# EAGLE design draft3_4lyr-autoroute (EAGLE 6.1)
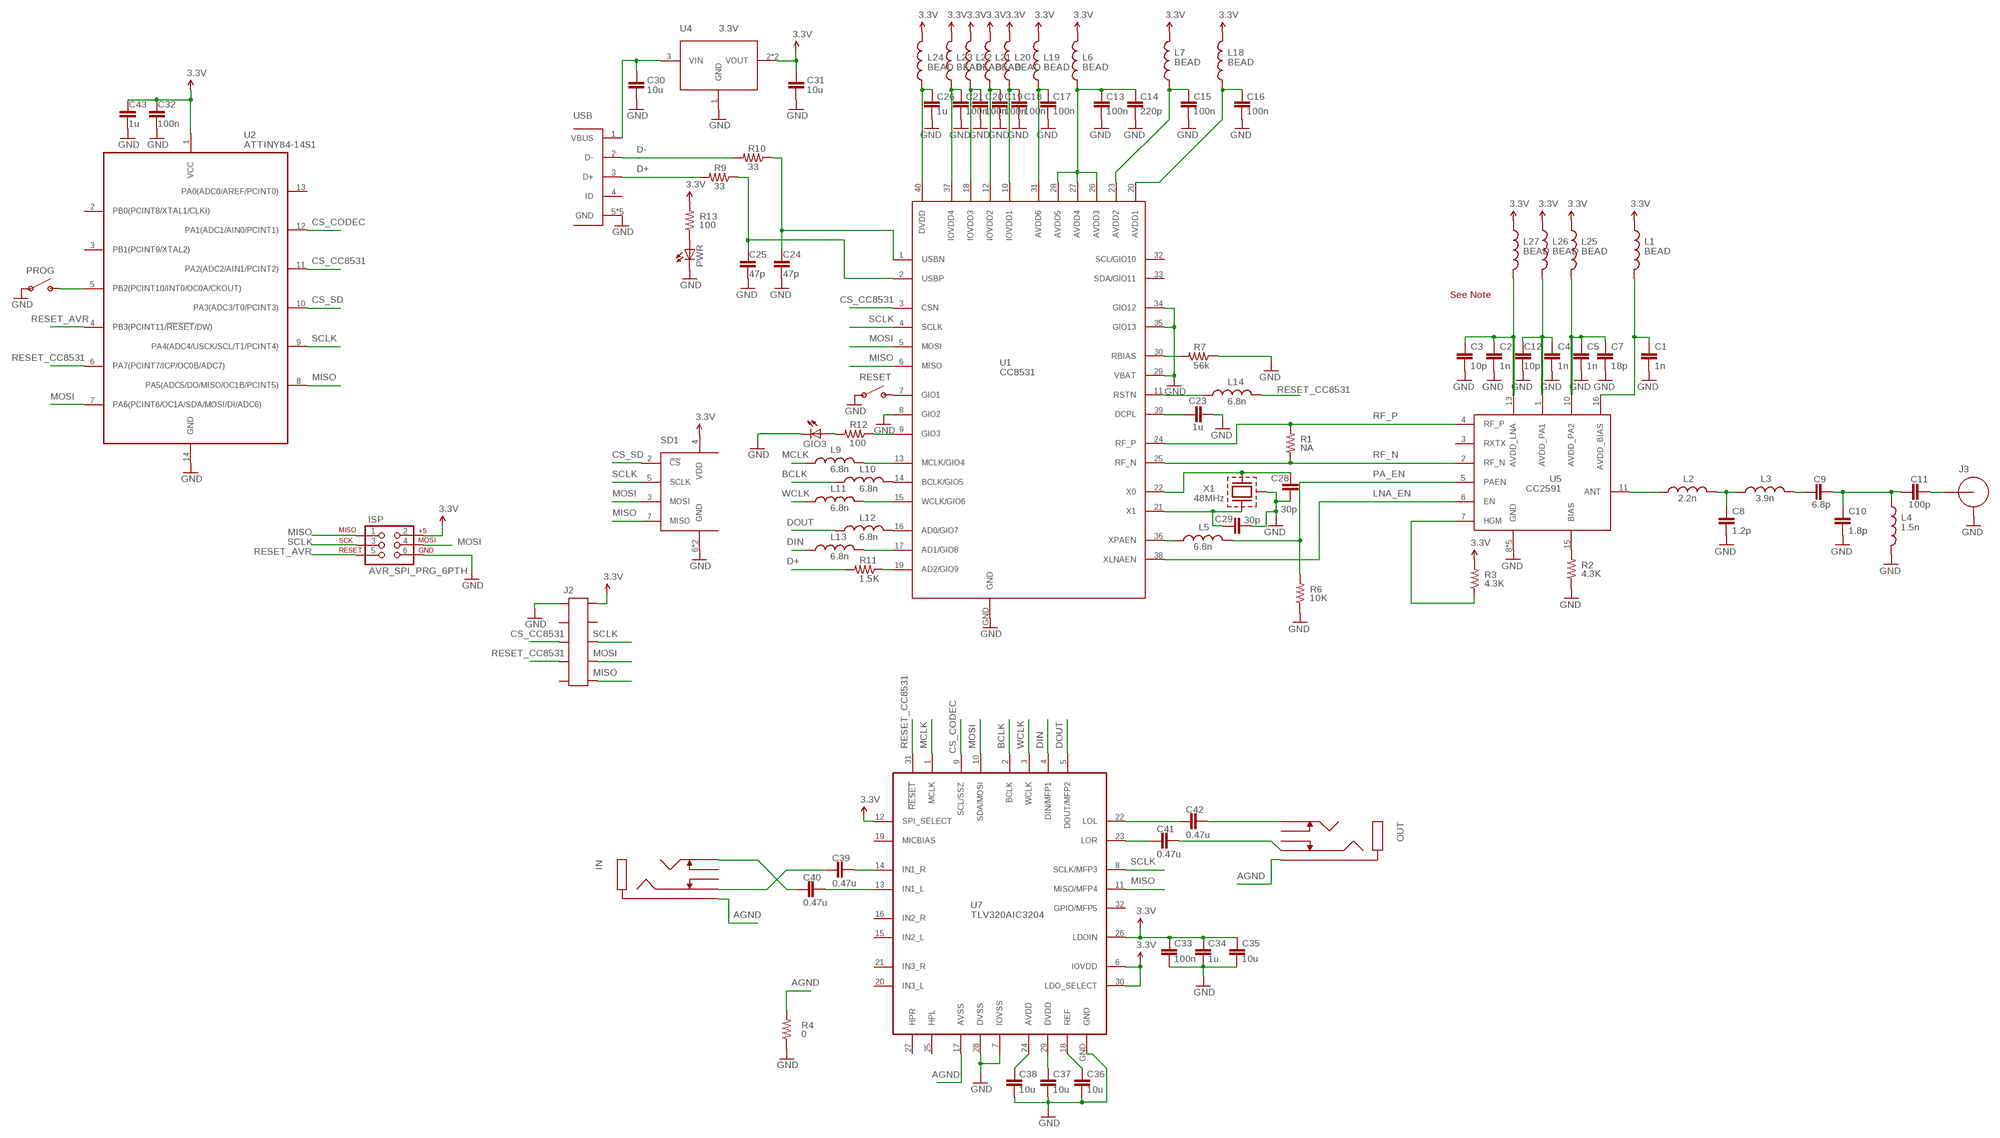
[diagram p0: schematic, sheet 1]

## Parts
C1  1n  C-EUC0603  [C0603]
C2  1n  C-EUC0603  [C0603]
C3  10p  C-EUC0603  [C0603]
C4  1n  C-EUC0603  [C0603]
C5  1n  C-EUC0603  [C0603]
C7  18p  C-EUC0603  [C0603]
C8  1.2p  C-EUC0603  [C0603]
C9  6.8p  C-EUC0603  [C0603]
C10  1.8p  C-EUC0603  [C0603]
C11  100p  C-EUC0603  [C0603]
C12  10p  C-EUC0603  [C0603]
C13  100n  C-EUC0603  [C0603]
C14  220p  C-EUC0603  [C0603]
C15  100n  C-EUC0603  [C0603]
C16  100n  C-EUC0603  [C0603]
C17  100n  C-EUC0603  [C0603]
C18  100n  C-EUC0603  [C0603]
C19  100n  C-EUC0603  [C0603]
C20  100n  C-EUC0603  [C0603]
C21  100n  C-EUC0603  [C0603]
C23  1u  C-EUC0603  [C0603]
C24  47p  C-EUC0603  [C0603]
C25  47p  C-EUC0603  [C0603]
C26  1u  C-EUC0603  [C0603]
C28  30p  C-EUC0603  [C0603]
C29  30p  C-EUC0603  [C0603]
C30  10u  C-EUC0603  [C0603]
C31  10u  C-EUC0603  [C0603]
C32  100n  C-EUC0603  [C0603]
C33  100n  C-EUC0603  [C0603]
C34  1u  C-EUC0603  [C0603]
C35  10u  C-EUC0603  [C0603]
C36  10u  C-EUC0603  [C0603]
C37  10u  C-EUC0603  [C0603]
C38  10u  C-EUC0603  [C0603]
C39  0.47u  C-EUC0603  [C0603]
C40  0.47u  C-EUC0603  [C0603]
C41  0.47u  C-EUC0603  [C0603]
C42  0.47u  C-EUC0603  [C0603]
C43  1u  C-EUC0603  [C0603]
GIO3  LEDCHIP-LED0603  [CHIP-LED0603]
IN  PHONE_SW  [35RAPC4BV4]
ISP  AVR_SPI_PRG_6PTH  [2X3]
J2  HEADER-10P-SMD-MALE  [10P-0.05-HEADER]
J3  SMA  [CONSMA003.031]
L1  BEAD  INDUCTOR0603  [0603]
L2  2.2n  INDUCTOR0603  [0603]
L3  3.9n  INDUCTOR0603  [0603]
L4  1.5n  INDUCTOR0603  [0603]
L5  6.8n  INDUCTOR0603  [0603]
L6  BEAD  INDUCTOR0603  [0603]
L7  BEAD  INDUCTOR0603  [0603]
L9  6.8n  INDUCTOR0603  [0603]
L10  6.8n  INDUCTOR0603  [0603]
L11  6.8n  INDUCTOR0603  [0603]
L12  6.8n  INDUCTOR0603  [0603]
L13  6.8n  INDUCTOR0603  [0603]
L14  6.8n  INDUCTOR0603  [0603]
L18  BEAD  INDUCTOR0603  [0603]
L19  BEAD  INDUCTOR0603  [0603]
L20  BEAD  INDUCTOR0603  [0603]
L21  BEAD  INDUCTOR0603  [0603]
L22  BEAD  INDUCTOR0603  [0603]
L23  BEAD  INDUCTOR0603  [0603]
L24  BEAD  INDUCTOR0603  [0603]
L25  BEAD  INDUCTOR0603  [0603]
L26  BEAD  INDUCTOR0603  [0603]
L27  BEAD  INDUCTOR0603  [0603]
OUT  PHONE_SW  [35RAPC4BV4]
PROG  SPST-SMD  [TACT_SW]
PWR  LEDCHIP-LED0603  [CHIP-LED0603]
R1  NA  R-US_R0603  [R0603]
R2  4.3K  R-US_R0603  [R0603]
R3  4.3K  R-US_R0603  [R0603]
R4  0  R-US_R0603  [R0603]
R6  10K  R-US_R0603  [R0603]
R7  56k  R-US_R0603  [R0603]
R9  33  R-US_R0603  [R0603]
R10  33  R-US_R0603  [R0603]
R11  1.5K  R-US_R0603  [R0603]
R12  100  R-US_R0603  [R0603]
R13  100  R-US_R0603  [R0603]
RESET  SPST-SMD  [TACT_SW]
SD1  MICROSDDM3AT  [DM3AT]
U1  CC8531  [S-PVQFN-N40]
U2  ATTINY84-14S1  [SOIC14]
U4  3.3V  NX1117C  [SOT-223]
U5  CC2591  [S-PVQFN-N16]
U7  TLV320AIC3204  [S-PVQFN-N32]
USB  USB_MICRO_AB  [USB_MICRO_AB]
X1  48MHz  XTAL-ABRACONABM3C  [ABM3C]

## Nets
3.3V: C31.1 C32.1 C33.1 C34.1 C35.1 C43.1 ISP.2 J2.2 L1.1 L6.2 L7.2 L18.2 L19.2 L20.2 L21.2 L22.2 L23.2 L24.2 L25.1 L26.1 L27.1 R3.2 R13.2 SD1.4(VDD) U2.1(VCC) U4.2(VOUT) U4.4(VOUT) U7.6(IOVDD) U7.12(SPI_SELECT) U7.26(LDOIN) U7.30(LDO_SELECT)
AGND: IN.1(GND) OUT.1(GND) R4.2 U7.17(AVSS)
AVDD_BIAS: C1.1 L1.2 U5.16(AVDD_BIAS)
AVDD_LNA: C2.1 C3.1 L27.2 U5.13(AVDD_LNA)
AVDD_PA1: C4.1 C12.1 L26.2 U5.1(AVDD_PA1)
AVDD_PA2: C5.1 C7.1 L25.2 U5.10(AVDD_PA2)
BCLK: L10.1 U7.2(BCLK)
CS_CC8531: J2.5 U1.3(CSN) U2.11(PA2(ADC2/AIN1/PCINT2))
CS_CODEC: U2.12(PA1(ADC1/AIN0/PCINT1)) U7.9(SCL/SSZ)
CS_SD: SD1.2(!CS) U2.10(PA3(ADC3/T0/PCINT3))
D+: R9.2 R11.2 USB.3(D+)
D-: R10.2 USB.2(D-)
DIN: L13.1 U7.4(DIN/MFP1)
DOUT: L12.1 U7.5(DOUT/MFP2)
GND: C1.2 C2.2 C3.2 C4.2 C5.2 C7.2 C8.2 C10.2 C12.2 C13.2 C14.2 C15.2 C16.2 C17.2 C18.2 C19.2 C20.2 C21.2 C23.2 C24.2 C25.2 C26.2 C28.2 C29.2 C30.2 C31.2 C32.2 C33.2 C34.2 C35.2 C36.2 C37.2 C38.2 C43.2 GIO3.C ISP.6 J2.1 J3.GND1(GND) J3.GND2(GND) J3.GND3(GND) J3.GND4(GND) L4.2 PROG.1 PROG.2 PWR.C R2.1 R4.1 R6.1 R7.1 RESET.1 RESET.2 SD1.6(GND) SD1.GND U1.8(GIO2) U1.29(VBAT) U1.34(GIO12) U1.35(GIO13) U1.GND U2.14(GND) U4.1(GND) U5.8(GND) U5.9(GND) U5.12(GND) U5.14(GND) U5.GND U7.7(IOVSS) U7.28(DVSS) U7.GND USB.5(GND) USB.GND1(GND) USB.GND2(GND) USB.GND3(GND) USB.GND4(GND) X1.2(CASE) X1.4(CASE)
IOVDD1: C24.1 R10.1 U1.1(USBN)
IOVDD2: C25.1 R9.1 U1.2(USBP)
LNA_EN: U1.38(XLNAEN) U5.6(EN)
MCLK: L9.1 U7.1(MCLK)
MISO: ISP.1 J2.10 SD1.7(MISO) U1.6(MISO) U2.8(PA5(ADC5/DO/MISO/OC1B/PCINT5)) U7.11(MISO/MFP4)
MOSI: ISP.4 J2.8 SD1.3(MOSI) U1.5(MOSI) U2.7(PA6(PCINT6/OC1A/SDA/MOSI/DI/ADC6)) U7.10(SDA/MOSI)
N$1: C29.1 U1.21(X1) X1.1
N$2: C28.1 U1.22(X0) X1.3
N$3: L14.1 U1.11(RSTN)
N$4: PROG.3 PROG.4 U2.5(PB2(PCINT10/INT0/OC0A/CKOUT))
N$5: L10.2 U1.14(BCLK/GIO5)
N$6: C30.1 U4.3(VIN) USB.1(VBUS)
N$7: R2.2 U5.15(BIAS)
N$8: R3.1 U5.7(HGM)
N$9: C11.2 J3.SIG
N$10: L12.2 U1.16(AD0/GIO7)
N$11: RESET.3 RESET.4 U1.7(GIO1)
N$12: C38.1 U7.24(AVDD)
N$13: L2.1 U5.11(ANT)
N$14: C8.1 L2.2 L3.1
N$15: C9.1 L3.2
N$16: C9.2 C10.1 C11.1 L4.1
N$17: C13.1 C14.1 L6.1 U1.26(AVDD3) U1.27(AVDD4) U1.28(AVDD5)
N$18: L5.1 U1.36(XPAEN)
N$19: R7.2 U1.30(RBIAS)
N$20: C36.1 U7.18(REF)
N$21: C23.1 U1.39(DCPL)
N$22: C15.1 L7.1 U1.23(AVDD2)
N$23: L9.2 U1.13(MCLK/GIO4)
N$24: R11.1 U1.19(AD2/GIO9)
N$25: L11.2 U1.15(WCLK/GIO6)
N$26: C16.1 L18.1 U1.20(AVDD1)
N$27: L13.2 U1.17(AD1/GIO8)
N$28: R12.1 U1.9(GIO3)
N$29: GIO3.A R12.2
N$30: C17.1 L19.1 U1.31(AVDD6)
N$31: PWR.A R13.1
N$32: C37.1 U7.29(DVDD)
N$33: C40.1 IN.2(L)
N$34: C39.2 U7.14(IN1_R)
N$35: C40.2 U7.13(IN1_L)
N$36: C39.1 IN.4(R)
N$37: C42.2 OUT.2(L)
N$38: C41.2 OUT.4(R)
N$39: C42.1 U7.22(LOL)
N$40: C41.1 U7.23(LOR)
N$41: C18.1 L20.1 U1.10(IOVDD1)
N$42: C19.1 L21.1 U1.12(IOVDD2)
N$43: C20.1 L22.1 U1.18(IOVDD3)
N$44: C21.1 L23.1 U1.37(IOVDD4)
N$45: C26.1 L24.1 U1.40(DVDD)
PA_EN: L5.2 R6.2 U5.5(PAEN)
RESET_AVR: ISP.5 U2.4(PB3(PCINT11/!RESET!/DW))
RESET_CC8531: J2.7 L14.2 U2.6(PA7(PCINT7/ICP/OC0B/ADC7)) U7.31(!RESET)
RF_N: R1.1 U1.25(RF_N) U5.2(RF_N)
RF_P: R1.2 U1.24(RF_P) U5.4(RF_P)
SCLK: ISP.3 J2.6 SD1.5(SCLK) U1.4(SCLK) U2.9(PA4(ADC4/USCK/SCL/T1/PCINT4)) U7.8(SCLK/MFP3)
WCLK: L11.1 U7.3(WCLK)
Unconnected: IN.3(R_SW) IN.5(L_SW) J2.3 J2.4 J2.9 OUT.3(R_SW) OUT.5(L_SW) U1.32(SCL/GIO10) U1.33(SDA/GIO11) U2.2(PB0(PCINT8/XTAL1/CLKI)) U2.3(PB1(PCINT9/XTAL2)) U2.13(PA0(ADC0/AREF/PCINT0)) U5.3(RXTX) U7.15(IN2_L) U7.16(IN2_R) U7.19(MICBIAS) U7.20(IN3_L) U7.21(IN3_R) U7.25(HPL) U7.27(HPR) U7.32(GPIO/MFP5) USB.4(ID)

## Notes on the sheet
- See Note

## Library data of the parts
C1-C5 C7-C21 C23-C26 C28-C43 = rcl:C-EU: CAPACITOR, European symbol
GIO3 PWR = led:LED: LED OSRAM: - CHIPLED LG R971, LG N971, LY N971, LG Q971, LY Q971, LO R971, LY R971 LH N974, LH R974 LS Q976, LO Q976, LY Q976 LO Q996 - Hyper CHIPLED LW Q18S LB Q993, LB Q99A, LB R99A - SideLED LS A670, LO A670, LY A670, LG A670, LP A670 LB A673, LV A673, LT A673, LW A673 LH A674 LY A675 LS A676, LA A676, LO A676, LY A676, LW A676 LS A679, LY A679, LG A679 - Hyper Micro SIDELED® LS Y876, LA Y876, LO Y876, LY Y876 LT Y87S - SmartLED LW L88C, LW L88S LB L89C, LB L89S, LG L890 LS L89K, LO L89K, LY L89K LS L896, LA L896, LO L896, LY L896 - TOPLED LS T670, LO T670, LY T670, LG T670, LP T670 LSG T670, LSP T670, LSY T670, LOP T670, LYG T670 LG T671, LOG T671, LSG T671 LB T673, LV T673, LT T673, LW T673 LH T674 LS T676, LA T676, LO T676, LY T676, LB T676, LH T676, LSB T676, LW T676 LB T67C, LV T67C, LT T67C, LS T67K, LO T67K, LY T67K, LW E67C LS E67B, LA E67B, LO E67B, LY E67B, LB E67C, LV E67C, LT E67C LW T67C LS T679, LY T679, LG T679 LS T770, LO T770, LY T770, LG T770, LP T770 LB T773, LV T773, LT T773, LW T773 LH T774 LS E675, LA E675, LY E675, LS T675 LS T776, LA T776, LO T776, LY T776, LB T776 LHGB T686 LT T68C, LB T68C - Hyper Mini TOPLED® LB M676 - Mini TOPLED Santana® LG M470 LS M47K, LO M47K, LY M47K Source: http://www.osram.convergy.de LUXEON: - LUMILED® LXK2-PW12-R00, LXK2-PW12-S00, LXK2-PW14-U00, LXK2-PW14-V00 LXK2-PM12-R00, LXK2-PM12-S00, LXK2-PM14-U00 LXK2-PE12-Q00, LXK2-PE12-R00, LXK2-PE12-S00, LXK2-PE14-T00, LXK2-PE14-U00 LXK2-PB12-K00, LXK2-PB12-L00, LXK2-PB12-M00, LXK2-PB14-N00, LXK2-PB14-P00, LXK2-PB14-Q00 LXK2-PR12-L00, LXK2-PR12-M00, LXK2-PR14-Q00, LXK2-PR14-R00 LXK2-PD12-Q00, LXK2-PD12-R00, LXK2-PD12-S00 LXK2-PH12-R00, LXK2-PH12-S00 LXK2-PL12-P00, LXK2-PL12-Q00, LXK2-PL12-R00 Source: www.luxeon.com KINGBRIGHT: KA-3528ASYC Source: www.kingbright.com
IN OUT = 00-EvaLibrary:PHONE_SW
ISP = SparkFun-Connectors:AVR_SPI_PRG_6: AVR ISP 6 Pin This is the reduced ISP connector for AVR programming. Common on Arduino. This footprint will take up less PCB space and can be used with a 10-pin to 6-pin adapter such as SKU: BOB-08508
J2 = 00-EvaLibrary:HEADER-10P
J3 = 00-EvaLibrary:SMA
L1-L7 L9-L14 L18-L27 = SparkFun:INDUCTOR: Inductors Basic Inductor/Choke - 0603 and 1206. Footprints are not proven and vary greatly between part numbers.
PROG RESET = 00-EvaLibrary:SPST
R1-R4 R6 R7 R9-R13 = rcl:R-US_: RESISTOR, American symbol
SD1 = 00-EvaLibrary:MICROSD
U1 = 00-EvaLibrary:CC8531
U2 = 00-EvaLibrary:ATTINY84
U4 = 00-EvaLibrary:NX1117C
U5 = 00-EvaLibrary:CC2591
U7 = 00-EvaLibrary:TLV320AIC3204
USB = 00-EvaLibrary:USB_MICRO_AB
X1 = 00-EvaLibrary:XTAL-ABRACON

## Board
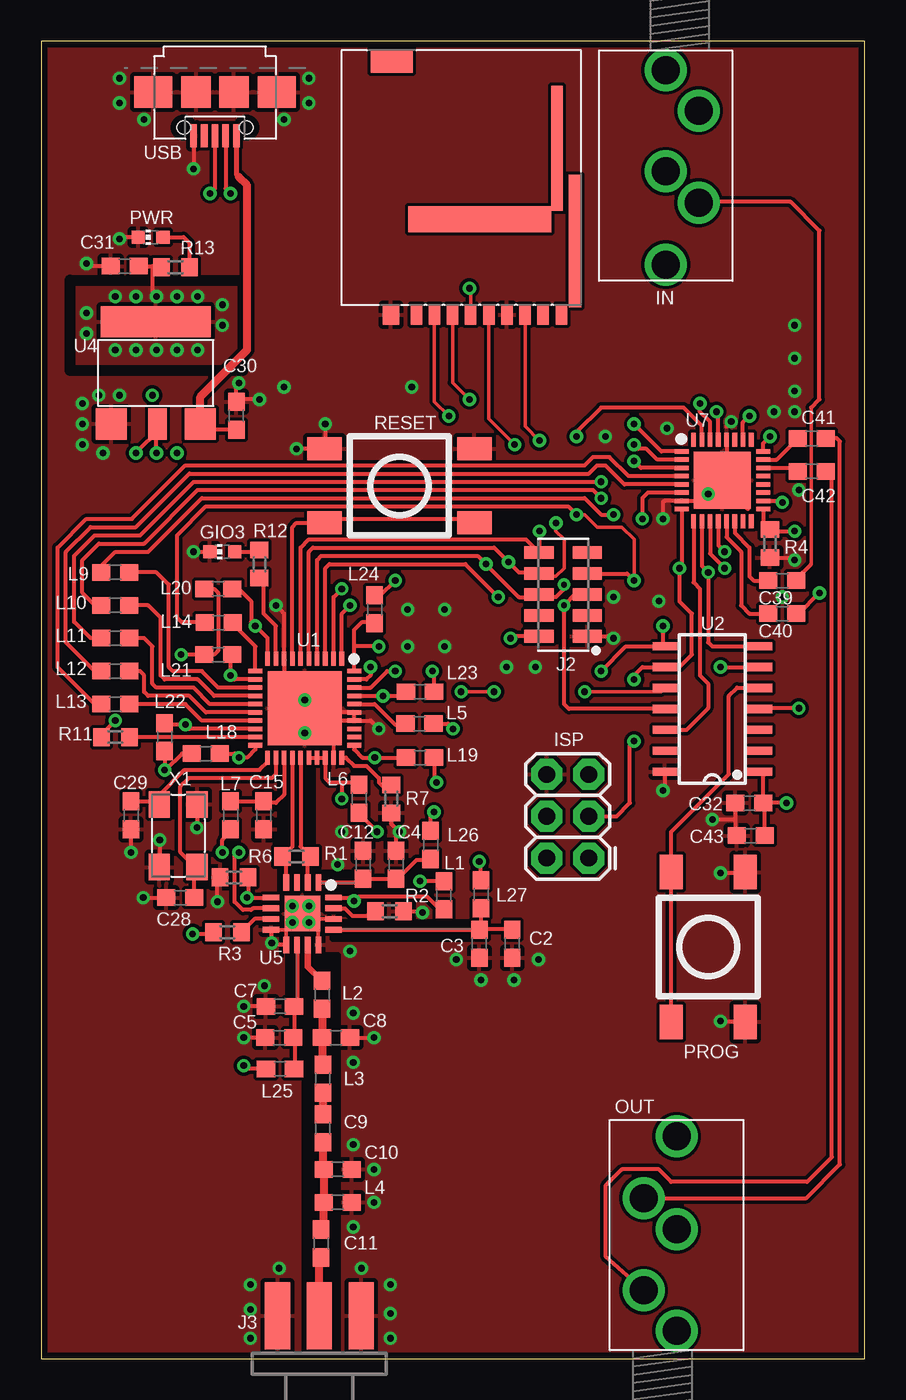
[diagram p1: board, top side]
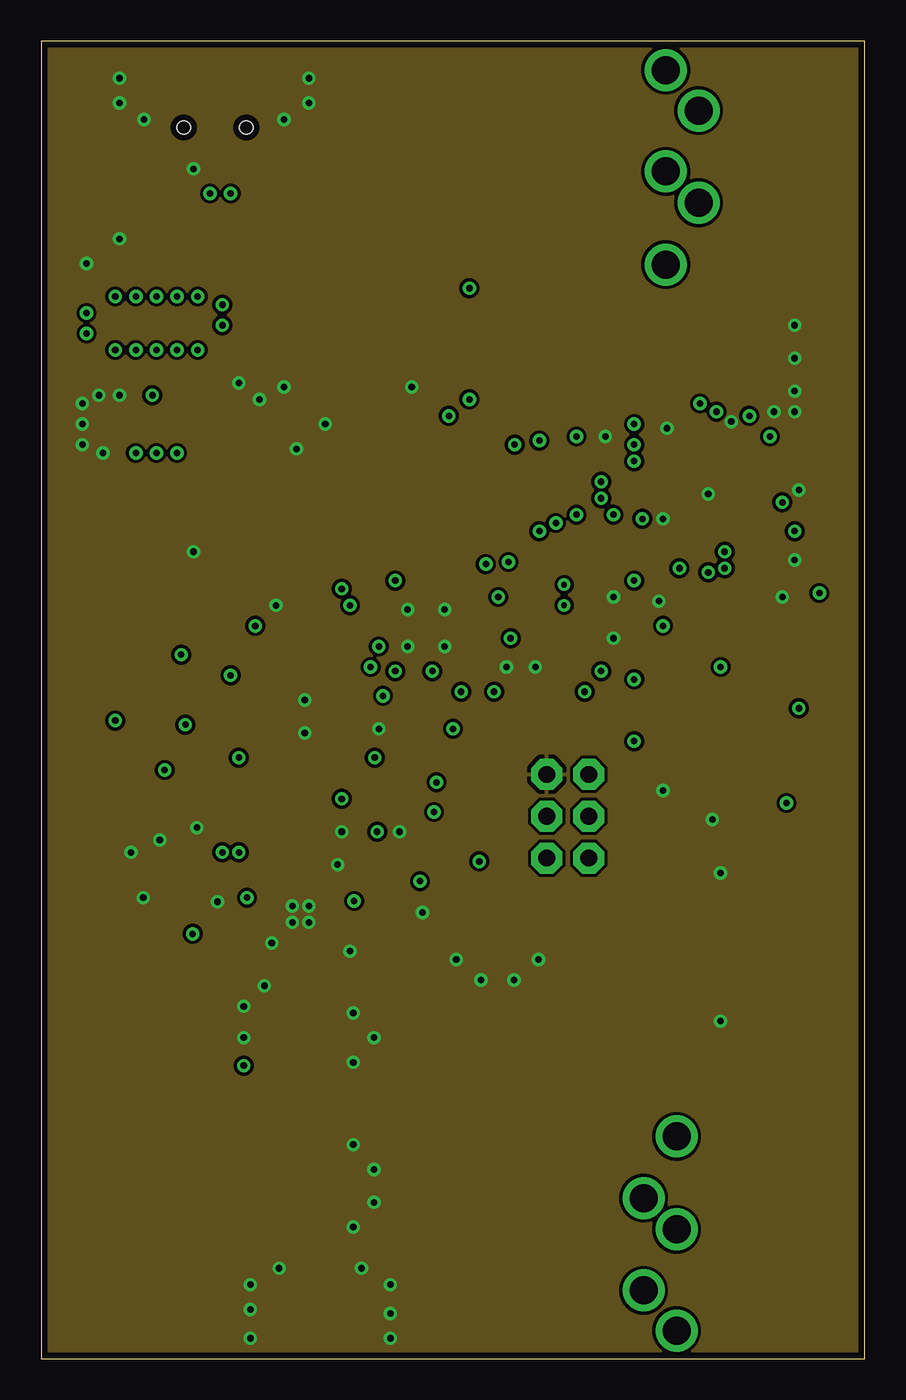
[diagram p2: board, inner layer Route2]
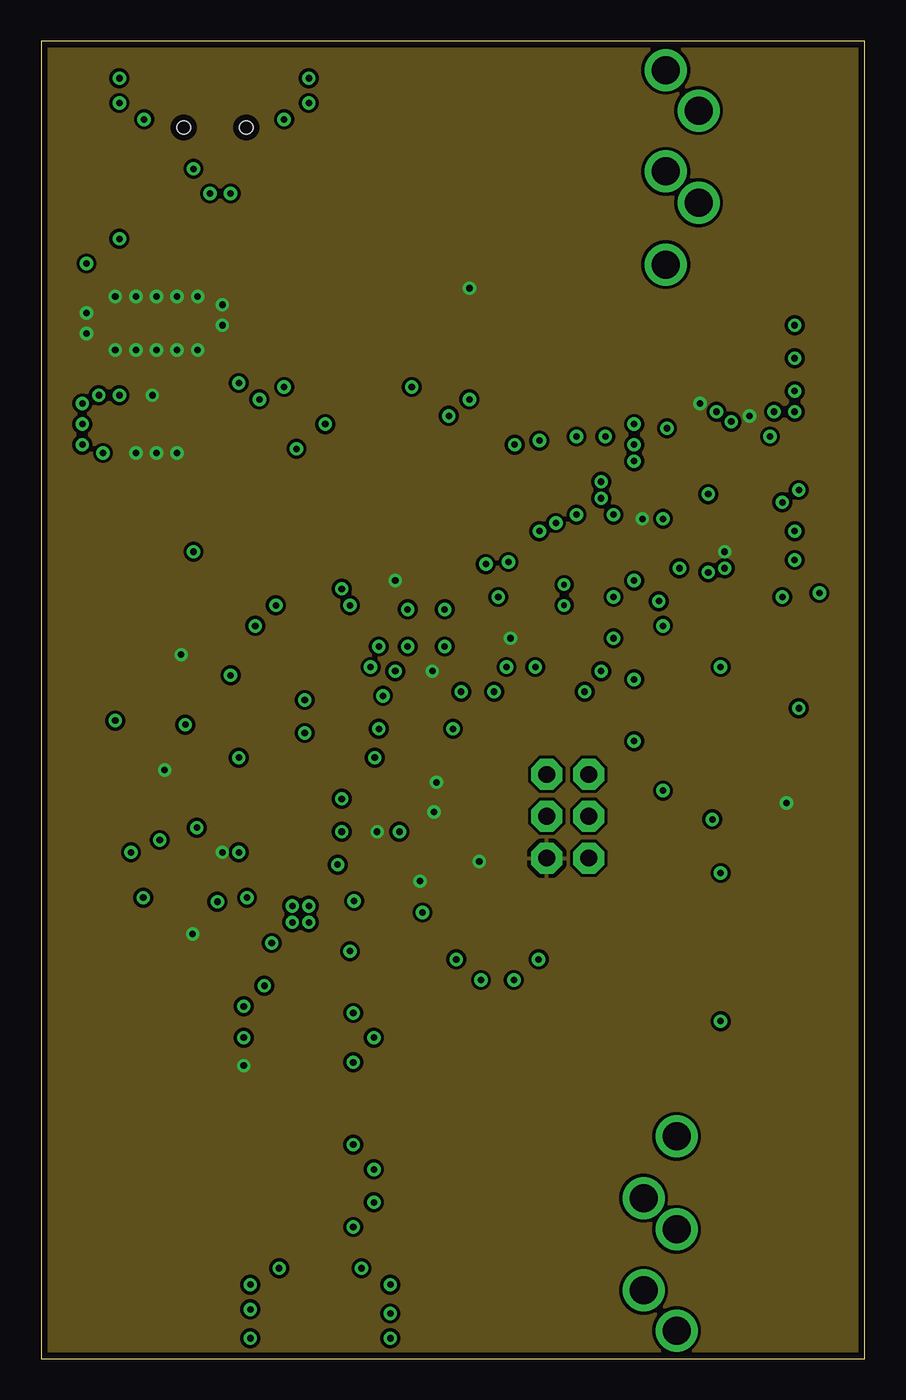
[diagram p3: board, inner layer Route3]
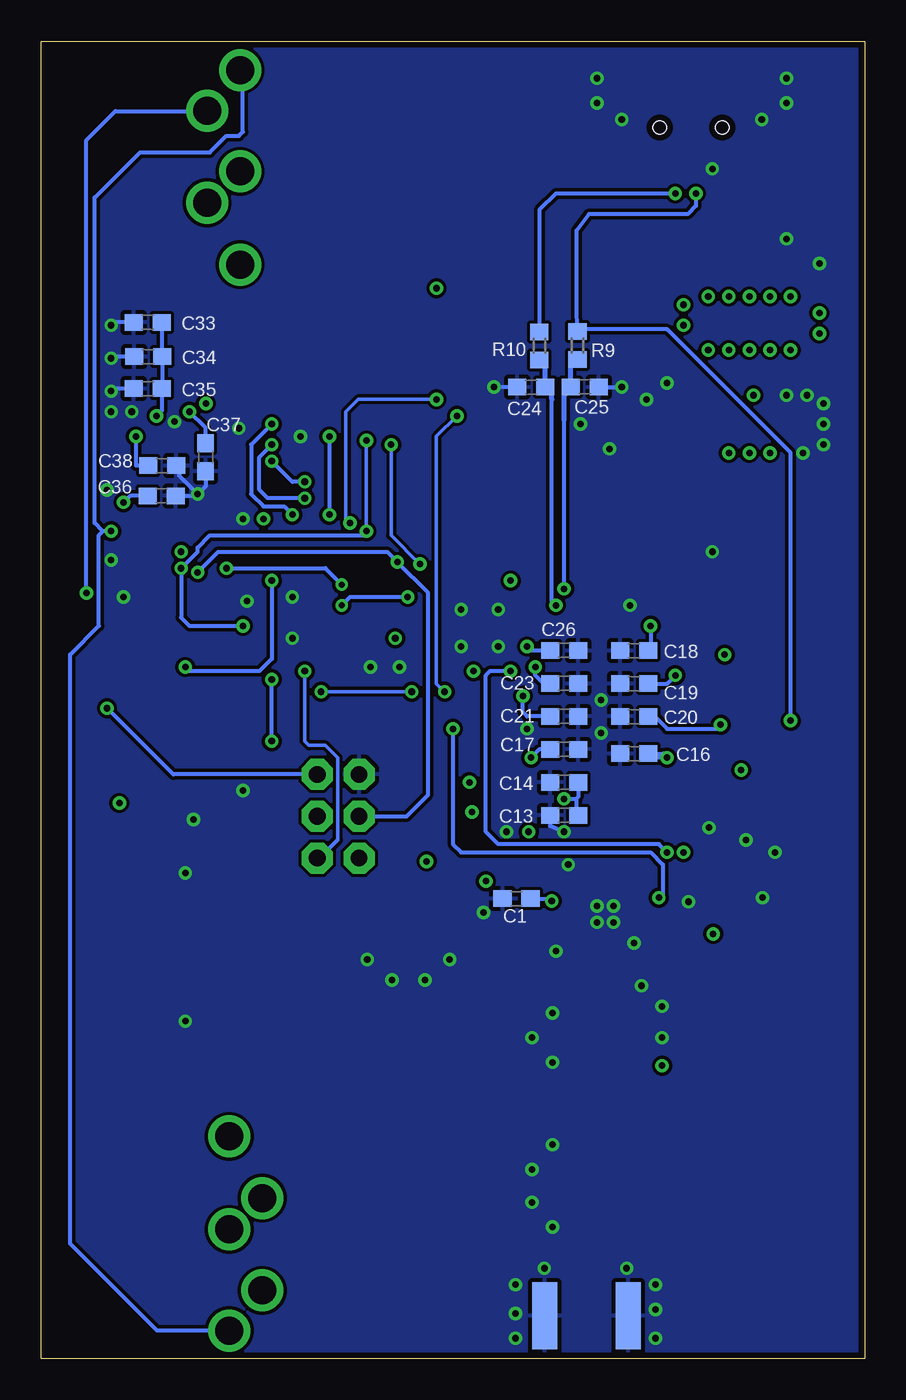
[diagram p4: board, bottom side, seen from below]

Size 50 x 80 mm. Coordinates in mm from the lower left corner, seen from the top.
Outline: 0,0 50,0 50,80 0,80 0,0
Copper layers (1+2*3+16): Top 0.035mm / dielectric 8mil / Route2 0.035mm / dielectric 40mil / Route3 0.035mm / dielectric 8mil / Bottom 0.035mm
Design rules: minimum track width 6mil, minimum drill 13mil, track to track 6mil, track to pad 6mil, pad to pad 6mil, via to via 6mil, smd to smd 6mil, copper to edge 15mil, drill to drill 6mil, minimum pad ring 10mil, minimum via ring 8mil, stop-mask expansion 4mil, vias tented up to drill 0mil, thermal gap 10mil
tRestrict: area 16,0.5 to 18,24.5; area 14.5,28.5 to 16.5,36.5; area 17.7,25.5 to 26.2,26.5; area 15,22 to 16,25.8; area 16.8,28.5 to 19.2,29.5; 4 lines

### Footprints (pad centres in the part's own frame; a part is rotated, then mirrored left to right if it is on the bottom)
C0603 = smd 1.1 x 1: 1 -0.85,0; 2 0.85,0
CHIP-LED0603 = smd 0.8 x 0.8: A 0,-0.75; C 0,0.75
35RAPC4BV4 = drill 1.7 pad 2.4: 1 1.2,-0.85; 2 3.65,1.15; 3 7.35,-0.85; 4 9.25,1.15; 5 13,-0.85
2X3 = drill 1.016 pad 1.88 octagon: 1 0,0; 2 0,2.54; 3 2.54,0; 4 2.54,2.54; 5 5.08,0; 6 5.08,2.54
10P-0.05-HEADER = smd 1.778 x 0.762: 1 -1.46,2.54; 2 1.46,2.54; 3 -1.46,1.27; 4 1.46,1.27; 5 -1.46,0; 6 1.46,0; 7 -1.46,-1.27; 8 1.46,-1.27; 9 -1.46,-2.54; 10 1.46,-2.54
CONSMA003.031 = smd 4.064 x 1.524: GND1 0,2.54; GND2 0,-2.54; SIG 0,0 | smd 4.064 x 1.524 bottom: GND3 0,2.54; GND4 0,-2.54
0603 = smd 1.1 x 1: 1 -0.85,0; 2 0.85,0
TACT_SW = smd 1.4 x 2.1: 1 2.25,4.55; 2 2.25,-4.55; 3 -2.25,4.55; 4 -2.25,-4.55
R0603 = smd 1 x 1.1: 1 -0.85,0; 2 0.85,0
DM3AT = smd 0.7 x 1.2: 1 0,0.6; 2 -1.1,0.6; 3 -2.2,0.6; 4 -3.3,0.6; 5 -4.4,0.6; 6 -5.5,0.6; 7 -6.6,0.6; 8 -7.7,0.6; SW -8.8,0.6 | smd 1 x 1.2: GND 1.55,0.6 | smd 8.7 x 1.6: NC1 -3.85,-5.2 | smd 0.7 x 7.6: NC2 -8.55,-9.5 | smd 0.75 x 8.05: NC3 -9.625,-3.875 | smd 2.55 x 1.35: NC4 1.5,-14.775
S-PVQFN-N40 = smd 0.85 x 0.28: 1 -3,2.25; 2 -3,1.75; 3 -3,1.25; 4 -3,0.75; 5 -3,0.25; 6 -3,-0.25; 7 -3,-0.75; 8 -3,-1.25; 9 -3,-1.75; 10 -3,-2.25; 21 3,-2.25; 22 3,-1.75; 23 3,-1.25; 24 3,-0.75; 25 3,-0.25; 26 3,0.25; 27 3,0.75; 28 3,1.25; 29 3,1.75; 30 3,2.25 | smd 0.28 x 0.85: 11 -2.25,-3; 12 -1.75,-3; 13 -1.25,-3; 14 -0.75,-3; 15 -0.25,-3; 16 0.25,-3; 17 0.75,-3; 18 1.25,-3; 19 1.75,-3; 20 2.25,-3; 31 2.25,3; 32 1.75,3; 33 1.25,3; 34 0.75,3; 35 0.25,3; 36 -0.25,3; 37 -0.75,3; 38 -1.25,3; 39 -1.75,3; 40 -2.25,3 | smd 4.5 x 4.5: GND 0,0
SOIC14 = smd 0.5 x 1.5: 1 3.81,2.875; 2 2.54,2.875; 3 1.27,2.875; 4 0,2.875; 5 -1.27,2.875; 6 -2.54,2.875; 7 -3.81,2.875; 8 -3.81,-2.875; 9 -2.54,-2.875; 10 -1.27,-2.875; 11 0,-2.875; 12 1.27,-2.875; 13 2.54,-2.875; 14 3.81,-2.875
SOT-223 = smd 1.9 x 1.9: 1 -2.7,-3.1; 3 2.7,-3.1 | smd 1.1 x 1.9: 2 0.1,-3.1 | smd 6.7 x 1.9: 4 0,3.1
S-PVQFN-N16 = smd 1 x 0.35: 1 -1.9,0.975; 2 -1.9,0.325; 3 -1.9,-0.325; 4 -1.9,-0.975; 9 1.9,-0.975; 10 1.9,-0.325; 11 1.9,0.325; 12 1.9,0.975 | smd 0.35 x 1: 5 -0.975,-1.9; 6 -0.325,-1.9; 7 0.325,-1.9; 8 0.975,-1.9; 13 0.975,1.9; 14 0.325,1.9; 15 -0.325,1.9; 16 -0.975,1.9 | smd 2.16 x 2.16: GND 0,0
S-PVQFN-N32 = smd 0.85 x 0.28: 1 -2.475,1.75; 2 -2.475,1.25; 3 -2.475,0.75; 4 -2.475,0.25; 5 -2.475,-0.25; 6 -2.475,-0.75; 7 -2.475,-1.25; 8 -2.475,-1.75; 17 2.475,-1.75; 18 2.475,-1.25; 19 2.475,-0.75; 20 2.475,-0.25; 21 2.475,0.25; 22 2.475,0.75; 23 2.475,1.25; 24 2.475,1.75 | smd 0.28 x 0.85: 9 -1.75,-2.475; 10 -1.25,-2.475; 11 -0.75,-2.475; 12 -0.25,-2.475; 13 0.25,-2.475; 14 0.75,-2.475; 15 1.25,-2.475; 16 1.75,-2.475; 25 1.75,2.475; 26 1.25,2.475; 27 0.75,2.475; 28 0.25,2.475; 29 -0.25,2.475; 30 -0.75,2.475; 31 -1.25,2.475; 32 -1.75,2.475 | smd 3.45 x 3.45: GND 0,0
USB_MICRO_AB = smd 0.4 x 1.4: 1 -1.3,2.65; 2 -0.65,2.65; 3 0,2.65; 4 0.65,2.65; 5 1.3,2.65 | smd 2.3 x 1.9: GND1 -3.75,0; GND4 3.75,0 | smd 1.8 x 1.9: GND2 -1.15,0; GND3 1.15,0 | hole 0.8: 1.9,2.15; -1.9,2.15
ABM3C = smd 1.6 x 1.3: 1 -1.9,-1.15; 2 1.9,-1.15; 3 1.9,1.15; 4 -1.9,1.15

### Placement (x,y rotation side)
C1  21.14,27.94 180 bottom
C2  28.6,25.2 270 top
C3  26.6,25.2 270 top
C4  21.55,30 90 top
C5  14.45,19.5 180 top
C7  14.5,21.4 180 top
C8  17.9,19.5 0 top
C9  17.1,14 270 top
C10  18,11.5 0 top
C11  17,7 270 top
C12  19.55,30 90 top
C13  18.25,33 180 bottom
C14  18.25,35 180 bottom
C15  13.5,33 270 top
C16  14,36.75 180 bottom
C17  18.25,37 0 bottom
C18  14,43 180 bottom
C19  14,41 180 bottom
C20  14,39 180 bottom
C21  18.25,39 0 bottom
C23  18.25,41 0 bottom
C24  20.25,59 180 bottom
C25  17,59 0 bottom
C26  18.25,43 0 bottom
C28  8.45,28 180 top
C29  5.45,33 270 top
C30  11.85,57.26 90 top
C31  5.07,66.35 180 top
C32  43,33.75 180 top
C33  43.53,62.93 180 bottom
C34  43.5,60.85 180 bottom
C35  43.52,58.9 180 bottom
C36  42.69,52.4 0 bottom
C37  40.02,54.74 270 bottom
C38  42.66,54.23 0 bottom
C39  45,47.25 180 top
C40  45,45.25 180 top
C41  46.78,55.87 0 top
C42  46.78,53.87 0 top
C43  43.07,31.77 180 top
GIO3  11,49 90 top
IN  38.77,79.44 270 top
ISP  33.24,30.4 90 top
J2  31.69,46.41 180 top
J3  16.89,2.62 90 top
L1  24.45,28.15 270 top
L2  17.05,22.1 270 top
L3  17.1,17 270 top
L4  18,9.5 0 top
L5  22.97,38.56 0 top
L6  19.3,34 270 top
L7  11.5,33 270 top
L9  4.5,47.75 0 top
L10  4.5,45.75 0 top
L11  4.5,43.75 0 top
L12  4.5,41.75 0 top
L13  4.5,39.75 0 top
L14  10.77,44.71 180 top
L18  10,36.75 180 top
L19  23,36.5 0 top
L20  10.75,46.75 180 top
L21  10.75,42.75 180 top
L22  7.5,37.75 270 top
L23  23,40.5 0 top
L24  20.25,45.5 90 top
L25  14.5,17.6 0 top
L26  23.65,31.2 270 top
L27  26.7,28.2 270 top
OUT  37.73,0.51 90 top
PROG  40.5,25 0 top
PWR  6.65,68.1 90 top
R1  15.5,30.5 180 top
R2  21.16,27.18 180 top
R3  11.3,25.9 180 top
R4  44.25,49.5 90 top
R6  11.71,29.23 0 top
R7  21.25,34 90 top
R9  17.44,61.52 90 bottom
R10  19.75,61.5 90 bottom
R11  4.5,37.75 180 top
R12  13.25,48.25 90 top
R13  8.16,66.27 180 top
RESET  21.75,53 90 top
SD1  22.78,63.99 180 top
U1  16,39.5 270 top
U2  40.75,39.46 270 top
U4  6.96,59.86 0 top
U5  15.86,27.03 270 top
U7  41.36,53.34 0 top
USB  10.55,76.91 180 top
X1  8.32,31.76 270 top

### Tracks (layer width: path | path; a pad name or v marks a point on that pad's centre or on a via)
3.3V  (via drill 0.4)
  Top 0.2: 9.5,63 7,63 | SD1.4 26.08,64.92 v26,65
  Top 0.254: L22.2 v7.5,35.75 7.5,35.7 8.55,36.75 L18.2 9.15,36.65 | v8.5,42.75 L21.2 10.5,42.75 10.75,43 10.75,46.5 10.5,46.75 L20.2 | L19.2 23.85,35.15 v24,35 | L23.2 23.85,41.65 v23.75,41.75 | L24.2 20.6,46.35 v21.5,47.25 | L6.2 19.3,33.1 v20.4,32 | L26.1 23.65,33.15 v23.85,33.2 | L27.1 26.7,30.1 v26.6,30.2 | L1.1 v23,29 | L25.1 12.5,17.6 v12.3,17.8 | v9.2,25.8 10.3,25.8 10.5,26 10.5,25.95 R3.2 | v11,30.75 11,31.5 11.5,32 L7.2 | U7.26 42.61,56.86 v43,57.25 | C43.1 43.92,33.68 C32.1 | C32.1 43.85,35.42 U2.1 | v45.25,33.75 C32.1 | U7.6 36.84,52.59 36.5,52.25 v36.5,51 | U7.12 41.11,49.39 v41.5,49 | J2.2 28.62,43.87 v28.5,43.75 | C31.1 6.75,66.35 | 6.75,66.35 7.15,66.35 7.25,66.25 7.27,66.27 R13.2 | 7.06,56.19 U4.2 7.06,56.94 7,57 v7,55 | v5.75,55 7.25,56.5 | U7.30 40.61,56.89 40,57.5 v40,58 | 6.75,66.35 6.75,64.75 v7,64.5
  Bottom 0.254: C33.1 42.68,60.88 C34.1 42.65,58.92 C35.1 42.67,57.58 v43,57.25
  other vias: 2.75,63.5 4.5,61.25 11,64 6.75,58.5 8.25,55 2.75,62.25 5.75,61.25 7,61.25 8.25,61.25 9.5,61.25 11,62.75 4.5,64.5 5.75,64.5 8.25,64.5 9.5,64.5
  pour Route3 (isolate 0.2): 0,0 50,0 50,80 0,80
  pour Top (isolate 0.2): 2,65.25 12,65.25 12,60.75 12,60.5 12,60.25 2,60.25
AGND  (via drill 0.4)
  Top 0.254: R4.2 43.84,50.77 U7.17 43.84,50.66 44.25,50.25 v45.75,50.25
  Bottom 0.254: v45.75,50.25 46.25,50.25 | 46.25,50.25 46.75,50.75 46.75,70.5 44,73.25 39.75,73.25 38.75,74.25 38,74.25 37.75,74.5 37.75,78.07 IN.1 | OUT.1 42.96,1.71 48.25,7 48.25,42.75 46.5,44.5 46.5,50 46.25,50.25
AVDD_BIAS  (via drill 0.4)
  Top 0.254: L1.2 24.2,27.3 23.45,28.05 19.25,28.05 v19,27.8 19,27.75 18.75,28 U5.16
  Bottom 0.254: C1.1 19.14,27.94 v19,27.8
AVDD_LNA
  Top 0.254: U5.13 26.45,26.05 26.5,26 | 26.5,26 26.6,25.9 | L27.2 26.7,26.1 | 26.7,26.1 28.5,26.1 | 28.5,26.1 28.6,26.1 | 26.7,26.1 26.65,26.1 C3.1 26.55,26.05 26.5,26 | C2.1 28.55,26.05 28.5,26.1
AVDD_PA1
  Top 0.254: U5.1 19.23,28.93 19.25,29.25 19.35,29.15 C12.1 C4.1 21.65,29.15 22.8,30.3 23.6,30.3 L26.2
AVDD_PA2
  Top 0.254: U5.10 15.54,21.64 15.4,21.5 C7.1 15.35,19.65 | 15.35,19.65 15.4,19.6 15.4,17.6 L25.2 | 15.35,19.65 C5.1
BCLK  (via drill 0.4)
  Top 0.254: L10.1 3.25,45.75 2.5,46.5 2.5,48.5 3.5,49.5 6.25,49.5 9.5,52.75 33.5,52.75 v34,52.25 | U7.2 37.41,54.59 36.75,55.25 36.25,55.25 v36,55.5
  Bottom 0.254: v34,52.25 36.25,52.25 36.75,52.75 36.75,54.75 v36,55.5
CS_CC8531  (via drill 0.35, 0.4)
  Top 0.254: U1.3 17.25,48 17.5,48.25 25.75,48.25 v27.75,46.25 | J2.5 33.06,46.5 32.5,46.5 v31.75,45.75 31.75,39.75 32.04,39.46 U2.11
  Bottom 0.254: v27.75,46.25 31.25,46.25 v31.75,45.75
CS_CODEC
  Top 0.254: U2.12 39.19,38.19 40.5,39.5 40.5,41 40,41.5 40,46.75 39.61,47.14 U7.9
CS_SD  (via drill 0.4)
  Top 0.2: SD1.2 23.88,58.12 v24.75,57.25 | v25.5,40.5 v27.5,40.5 | v33,40.5 37.65,40.5 U2.10
  Bottom 0.2: v24.75,57.25 26,56 26,41 v25.5,40.5 | v27.5,40.5 v33,40.5
D+  (via drill 0.4)
  Top 0.254: R11.2 3.65,37.9 v4.5,38.75 | USB.3 10.55,71.05 v10.25,70.75
  Bottom 0.254: v4.5,38.75 4.5,55 12,62.5 17.25,62.5 17.44,62.31 | v10.25,70.75 10.25,70 10.75,69.5 16.75,69.5 17.5,68.5 17.5,63.43 R9.2 17.44,62.31 | 17.44,62.31 17.5,62.25
D-  (via drill 0.4)
  Top 0.254: USB.2 11.2,71.05 v11.5,70.75
  Bottom 0.254: v11.5,70.75 18.75,70.75 19.75,69.75 R10.2
DIN
  Top 0.254: L13.1 3.25,39.75 1,42 1,49.25 2.75,51 5.5,51 8.75,54.25 33,54.25 33.5,54.75 34.5,54.75 35.66,53.59 U7.4
DOUT
  Top 0.254: L12.1 3.25,41.75 1.5,43.5 1.5,49 3,50.5 5.75,50.5 9,53.75 33.25,53.75 33.75,54.25 34.25,54.25 35.41,53.09 U7.5
GND  (via drill 0.4)
  Top 0.2: U5.14 16.3,26.7 16,27 15.89,27 U5.GND | U5.12 16.84,26.05 U5.GND | U5.8 14.88,26.05 | U5.9 14.88,26.05 | 14.88,26.05 U5.GND | U1.29 17.75,37.75 16.25,39.25
  Top 0.254: v14.25,45.75 14.75,45.25 U1.8 14.75,40.75 U1.GND 16.25,39.25 | R2.1 23.07,27.18 v23.15,27.1 | 25.3,24.35 v25.2,24.25 | 28.75,23.05 v28.7,23 | 26.65,23.05 v26.7,23 | 30.1,24.35 v30.2,24.25 | C4.2 21.55,31.8 v21.75,32 21.25,32.5 R7.1 | U5.8 13.96,25.29 v14,25.25 14.12,25.13 U5.9 | C29.2 v5.45,30.75 | X1.4 9.47,32.27 v9.45,32.25 | v6.2,28 7.7,28 | 6.81,29.5 X1.2 | v7.2,31.5 7.2,30 | 16.75,38.75 16.25,39.25 | U1.34 U1.35 16.25,39.25 | U1.34 20,38.75 v20.5,38.25 | U1.34 17,38.75 16.25,39.5 | C8.2 v20.2,19.5 | C7.2 v12.3,21.4 | C5.2 v12.3,19.5 | v10.7,27.75 10.7,29.07 R6.1 | v9.25,49 GIO3.C | 41.61,53.61 41.25,53.25 | v37.75,51 37.75,52 37.84,52.09 U7.7 40.11,52.09 U7.GND 41.61,53.59 41.61,53.61 | J2.1 34.63,43.87 v34.75,43.75 | 42.91,51.59 41.25,53.25 | U7.28 41.61,53.89 | 41.61,53.89 41.75,53.75 | 41.61,56.61 41.75,56.75 | C32.2 42.15,32.75 | 42.15,32.75 42.15,31.84 C43.2 | v40.75,32.75 42.15,32.75 | v41.25,29.5 42.75,29.5 | v41.25,20.5 42.75,20.5 | U2.14 37.88,34.62 v37.75,34.5 | 41.61,53.89 41.61,53.61 | 41.25,53.25 v40.5,52.5 | C31.2 2.9,66.35 v2.75,66.5 | C30.2 11.85,59.1 v12,59.25 | v13.25,58.25 11.75,58.25 | RESET.1 v15.5,55.25 | v17.25,56.75 17.25,55.25 | PWR.C 4.85,68.1 v4.75,68 | USB.5 v9.25,72.25 | R4.1 45.65,48.65 v45.75,48.5
  Top 0.3: 4.5,57 4.75,57.25 4.5,57.5 4.5,57.25 4.25,57 | 4.5,57 U4.1 | 4.25,57 3.5,57 | 4.25,57.25 4.5,57 | 4.5,57 4.25,57 | 4.25,57 4,56.75
  Bottom 0.254: 19.4,33 C13.2 19.1,32.35 v18.25,32 | C35.2 45.6,58.9 v45.75,58.75 | C34.2 45.65,60.85 v45.75,60.75 | C33.2 45.57,62.93 v45.75,62.75 | C37.2 40.02,52.98 v40.5,52.5 | C36.2 40.6,52.4 v40.5,52.5 | C38.2 41.63,54.23 | 41.63,54.23 41.61,54.25 | 41.63,54.23 41.63,53.63 v40.5,52.5 | C25.2 v14.75,59 | C24.2 v22.5,59
  other vias: 18.75,24.75 41.9,56.9 2.5,56.75 3.5,58.5 2.5,55.5 4.75,58.5 2.5,58 3.75,55 4.75,77.75 4.75,76.25 6.25,75.25 16.25,77.75 16.25,76.25 14.75,75.25 16,40 16,38 44.5,57.5 45.75,57.5 38,56.5 34.25,56 18,30 18.95,21 18.95,18 18.95,13 20.2,11.5 20.2,9.5 18.95,8 22.25,43.25 22.25,45.5 24.5,45.5 24.5,43.25 30,42 28.25,42 15.25,26.5 15.25,27.5 16.25,27.5 16.25,26.5 13.55,22.65 37.5,46 46,52.75 34.75,46.25 45,46.25 21.2,1.25 21.2,2.75 21.2,4.5 19.45,5.5 14.45,5.5 12.7,4.5 12.7,3 12.7,1.25
  pour Route2 (isolate 0.2): 0,0 50,0 50,80 0,80
  pour Top (isolate 0.2): 0,80 50,80 50,0 0,0
  pour Bottom (isolate 0.2): 0,80 50,80 50,0 0,0
IOVDD1  (via drill 0.4)
  Top 0.254: U1.1 18.25,45.25 v18.75,45.75
  Bottom 0.254: v18.75,45.75 19,46 19,58.25
  Bottom 0.3: 19,58.25 19,58.6 C24.1 19.4,60.3 R10.1
IOVDD2  (via drill 0.4)
  Top 0.254: U1.2 17.75,46.25 v18.25,46.75
  Bottom 0.254: v18.25,46.75 18.25,57 | C25.1 17.85,58.9 17.88,58.88
  Bottom 0.3: 18.25,57 18.25,58.5 17.88,58.88 17.75,59 | C25.1 17.85,60.26 R9.1
LNA_EN  (via drill 0.4)
  Top 0.254: U1.38 20,40.75 21,41.75 v21.5,41.75 | U5.6 12.86,27.36 12.75,27.25 12.25,27.25 11.75,27.75 11.75,30.5 v12,30.75
  Bottom 0.254: v12,30.75 12.5,31.25 22.25,31.25 23,32 23,41.5 22.75,41.75 v21.5,41.75
MCLK  (via drill 0.4)
  Top 0.254: L9.1 3.65,48.15 4.5,49 6.5,49 9.75,52.25 33,52.25 34,51.25 v34.75,51.25 | U7.1 37.66,55.09 v36,56.75
  Bottom 0.254: v36,56.75 37.25,55.5 37.25,52.5 36.5,51.75 35.25,51.75 v34.75,51.25
MISO  (via drill 0.4)
  Top 0.2: SD1.7 29.38,56.62 v30.25,55.75
  Top 0.254: U1.6 15.75,49.25 16.25,49.75 29.43,49.75 J2.10 30.25,48.97 v30.25,50.25 | U7.11 40.61,48.89 v41.5,48 | v37.75,44.5 37.75,43.4 U2.8 37.85,43.25 35.5,43.25 v34,41.75
  Bottom 0.2: v30.25,55.75 v30.25,50.25 | 32,31.5 32,36.5 32.75,37.25 33.75,37.25 34,37.5 v34,41.75
  Bottom 0.254: v30.25,50.25 30.5,50 39.75,50 40.5,49.25 40.5,49 v41.5,48 41.5,45 41,44.5 v37.75,44.5 | ISP.1 33.1,30.4 32,31.5
MOSI  (via drill 0.4)
  Top 0.2: SD1.3 24.98,59.27 v26,58.25 | v31.25,50.75 31.25,50.25 31.75,49.75 31.75,48 31.25,47.5 30.5,47.5 30.25,47.75
  Top 0.254: U1.5 16.25,49 16.5,49.25 27.5,49.25 v28.38,48.38 29,47.75 30.16,47.75 J2.8 30.23,47.73 30.25,47.75 | U7.10 40.11,48.14 v40.5,47.75 40.5,43.5 40.75,43.25 43.6,43.25 U2.7
  Bottom 0.2: v26,58.25 30.75,58.25 31.5,57.5 31.5,51 v31.25,50.75
  Bottom 0.254: v40.5,47.75 39.25,49 29,49 v28.38,48.38 26.5,46.5 26.5,34.25 27.81,32.94 ISP.4
N$1
  Top 0.254: U1.21 13.75,36.25 13.25,35.75 8.7,35.75 7.17,34.22 X1.1 6.98,33.85 C29.1
N$2
  Top 0.254: U1.22 14.25,35.5 14,35.25 8.95,35.25 8.45,34.75 8.45,30.75 9.34,29.86 X1.3 9.3,29.69 C28.1
N$3
  Top 0.254: U1.11 13,43.25 11.54,44.71 L14.1
N$4
  Top 0.254: U2.5 43.6,40.75 42.25,40.75 41.75,40.25 41.75,35.5 38.25,32 PROG.3 PROG.4
N$5
  Top 0.254: U1.14 10.5,40.25 9.5,41.25 7.5,41.25 7.25,41.5 7.25,45 6.5,45.75 L10.2
N$6
  Top 0.254: C30.1 10.09,56.41 9.75,56.75 | 9.5,57 9.75,56.75 | 9.75,56.75 U4.3
  Top 0.3: USB.1 11.85,71.9 12,71.75
  Top 0.5: U4.3 9.66,58.41 12.5,61.25 12.5,71.25 12,71.75
N$7
  Top 0.254: U5.15 18.45,27.36 18.9,26.9 19.8,26.9 20.2,27.3 | 20.2,27.3 20.3,27.4 | R2.2 20.2,27.3
N$8
  Top 0.254: U5.7 12.96,26.7 R3.1
N$9
  Top 0.5: J3.SIG 16.89,6.04 C11.2
N$10
  Top 0.254: U1.16 10,39.25 9,40.25 6.5,40.25 6.25,40.5 6.25,41.5 6,41.75 L12.2
N$11
  Top 0.254: U1.7 15.25,50.5 15.5,50.75 17,50.75 | 17,50.75 17.25,51 26,51 26.12,50.88 26.25,50.75 RESET.4 | 17,50.75 RESET.3
N$12  (via drill 0.4)
  Top 0.254: U7.24 43.84,55.59 v44.25,56
  Bottom 0.254: v44.25,56 44.25,54.25 43.5,54.25 C38.1
N$13
  Top 0.4: U5.11 16.18,23.82 L2.1
N$14
  Top 0.5: L2.2 C8.1 17.05,17.9 L3.1
N$15
  Top 0.254: 17.1,14.55 C9.1
  Top 0.5: L3.2 C9.1
N$16
  Top 0.254: 17.15,8.05 17,7.9 C11.1
  Top 0.5: C9.2 17.1,11.55 C10.1 L4.1 17.15,8.05
N$17  (via drill 0.4)
  Top 0.254: U1.26 U1.27 U1.28 17.25,35.25 17.5,35 18.25,35 | 18.25,35 19,35 19.25,34.75 19.3,34.8 L6.1 | 18.25,35 v18.25,34
  Bottom 0.254: v18.25,34 17.5,34 | 17.5,34 17.5,33.1 C13.1 | C14.1 17.4,34.1 17.5,34
N$18
  Top 0.254: U1.36 20.25,39.75 21.5,38.5 22.06,38.5 L5.1
N$19
  Top 0.254: U1.30 18.5,36.5 19,36 19.75,36 20.5,35.25 20.5,35 20.75,34.75 20.85,34.85 R7.2
N$20  (via drill 0.4)
  Top 0.254: U7.18 44.91,52.09 v45,52
  Bottom 0.254: 43.64,52.5 C36.1 44.6,52.4 v45,52
N$21  (via drill 0.4)
  Top 0.254: v20,42 20,41.5 19.75,41.25 U1.39
  Bottom 0.254: C23.1 19.5,41 20,41.5 v20,42
N$22
  Top 0.254: L7.1 C15.1 13.6,33.75 14.25,33.75 14.75,34.25 U1.23
N$23
  Top 0.254: U1.13 10.75,40.75 9.75,41.75 8,41.75 7.75,42 7.75,47 7,47.75 L9.2
N$24
  Top 0.254: U1.19 R11.1
N$25
  Top 0.254: U1.15 10.25,39.75 9.25,40.75 7,40.75 6.75,41 6.75,43.25 6.25,43.75 L11.2
N$26  (via drill 0.4)
  Top 0.254: U1.20 13,37 12.5,36.5 v12,36.5 11.75,36.75 L18.1
  Bottom 0.254: v12,36.5 13,36.5 13.25,36.75 C16.1 12.25,36.75 v12,36.5
N$27
  Top 0.254: U1.17 9.75,38.75 8.75,39.75 L13.2 5.25,39.75
N$28
  Top 0.254: U1.9 14.25,44.5 13.5,45.25 13.5,47 13.25,47.25 R12.1
N$29
  Top 0.254: GIO3.A 13.15,49 R12.2
N$30  (via drill 0.4)
  Top 0.254: U1.31 19,37 19.5,36.5 v20.25,36.5 L19.1
  Bottom 0.254: C17.1 19.75,37 v20.25,36.5
N$31
  Top 0.254: PWR.A 8.65,68.1 9,67.75 R13.1 | 9,66.25 R13.1 | R13.1
N$32  (via drill 0.4)
  Top 0.254: U7.29 41.11,57.39 v41,57.5
  Bottom 0.254: C37.1 40.02,56.52 v41,57.5
N$33  (via drill 0.4)
  Top 0.254: C40.1 46,45.25 v47.25,46.5
  Bottom 0.254: v47.25,46.5 47.25,74 45.5,75.75 40.46,75.75 IN.2
N$34
  Top 0.254: U7.14 42.11,50.14 43,49.25 43,47.5 43.25,47.25 C39.2 44.25,47.25
N$35
  Top 0.254: U7.13 41.61,49.89 42.5,49 42.5,45.75 43,45.25 C40.2
N$36
  Top 0.2: 46.75,48.25 46.75,57.75
  Top 0.254: C39.1 45.85,47.35 46.75,48.25 | 46.75,57.75 47.25,58.25 47.25,68.5 45.5,70.25 40.48,70.25 IN.4
N$37
  Top 0.254: 47.63,53.62 C42.2 47.66,53.9 47.7,53.9 48,53.6 48,12.25 46.5,10.75 38.25,10.75 37.5,11.5 35.25,11.5 34.25,10.5 34.25,6.24 OUT.2
N$38
  Top 0.254: OUT.4 46.46,9.76 48.5,11.8 48.5,55.7 48.3,55.9 47.6,55.9 C41.2
N$39
  Top 0.254: U7.22 45.71,54.09 C42.1
N$40
  Top 0.254: U7.23 44.65,54.59 C41.1
N$41  (via drill 0.4)
  Top 0.254: U1.10 13.75,43.75 v13,44.5 12.75,44.75 12.75,46 12,46.75 L20.1
  Bottom 0.254: v13,44.5 13,43.15 C18.1
N$42  (via drill 0.4)
  Top 0.254: U1.12 11.75,41.25 v11.5,41.5 11.5,42.65 L21.1
  Bottom 0.254: C19.1 12,41 v11.5,41.5
N$43  (via drill 0.4)
  Top 0.254: U1.18 9,38.25 v8.75,38.5 7.6,38.5 L22.1
  Bottom 0.254: C20.1 12.75,39 12,38.25 9,38.25 v8.75,38.5
N$44  (via drill 0.4)
  Top 0.254: U1.37 v20.75,40.25 21.65,40.25 L23.1
  Bottom 0.254: C21.1 20.5,39 20.75,39.25 v20.75,40.25
N$45  (via drill 0.4)
  Top 0.254: U1.40 19,43.25 | 19,43.25 19,44.25 19.5,44.75 20.25,44.75 L24.1 | v20.5,43.25 19,43.25
  Bottom 0.254: C26.1 20.25,43 v20.5,43.25
PA_EN  (via drill 0.4)
  Top 0.254: L5.2 24.69,38.56 v25,38.25 | U5.5 v12.5,28 12.56,28.06 R6.2
  Bottom 0.254: v25,38.25 25,31.25 24.5,30.75 13,30.75 12.25,30 12.25,28.25 v12.5,28
RESET_AVR  (via drill 0.4)
  Top 0.254: v46,39.5 43.66,39.5 U2.4
  Bottom 0.254: ISP.5 41.98,35.48 v46,39.5
RESET_CC8531  (via drill 0.4)
  Top 0.2: 32.25,51.25 33,51.25 33.75,50.5 35.25,50.5 36,49.75 v36,47.25
  Top 0.254: U7.31 40.11,56.64 39,57.75 34,57.75 32.5,56.25 v32.5,56 | 32.25,51.25 v32.5,51.25 32,51.75 10,51.75 8.25,50 8.25,45 8.54,44.71 L14.2 | 33.08,47.75 J2.7 35.57,47.68 v36,47.25 | v41.25,42 U2.6
  Bottom 0.254: v32.5,56 v32.5,51.25 | v36,47.25 36,42.5 36.75,41.75 41,41.75 v41.25,42
RF_N
  Top 0.254: U5.2 16.18,30.34 R1.1 15.75,31.1 U1.25
RF_P
  Top 0.254: U1.24 15.25,31.1 R1.2 14.88,30.27 U5.4
SCLK  (via drill 0.35, 0.4)
  Top 0.2: SD1.5 27.18,57.07 v28.75,55.5
  Top 0.254: U1.4 16.75,48.5 17,48.75 26.5,48.75 v27,48.25 29,46.25 30.07,46.25 J2.6 30.39,46.25 31.25,46.25 31.75,46.75 v31.75,47 | U7.8 38.88,48.13 v38.75,48 38.75,46 39.5,45.25 39.5,42.75 38.75,42 U2.9 36.5,42 36,41.5 v36,41.25 | ISP.3 34.94,32.94 35.75,33.75 35.75,37.25 v36,37.5
  Bottom 0.2: v28.75,55.5 28.75,50 v27,48.25
  Bottom 0.254: v38.75,48 32.75,48 v31.75,47 | v36,37.5 v36,41.25
WCLK  (via drill 0.4)
  Top 0.254: L11.1 3,43.75 2,44.75 2,48.75 3.25,50 6,50 9.25,53.25 v34,53.25 | U7.3 36.41,54.09 v36,54.5
  Bottom 0.254: v34,53.25 34.75,53.25 v36,54.5

### Text on the board
tDocu: AVDD_PA1 | 2.05mm | AVDD_LNA | AVDD_PA2 | 7.80mm | 2.70mm